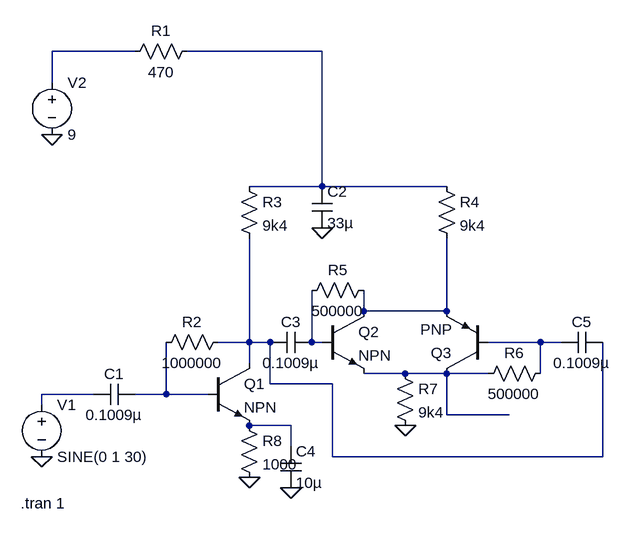
[diagram p0: schematic pushmepullyou.asc]
pushmepullyou.asc, the LTspice schematic file:
Version 4
SHEET 1 920 680
WIRE 128 -96 0 -96
WIRE 416 -96 208 -96
WIRE 0 -48 0 -96
WIRE 416 112 416 -96
WIRE 416 112 304 112
WIRE 608 112 416 112
WIRE 480 304 480 272
WIRE 608 304 608 192
WIRE 608 304 480 304
WIRE 304 352 304 192
WIRE 304 352 256 352
WIRE 336 352 304 352
WIRE 400 352 400 272
WIRE 416 352 400 352
WIRE 752 352 672 352
WIRE 784 352 752 352
WIRE 304 384 304 352
WIRE 544 400 480 400
WIRE 608 400 544 400
WIRE 672 400 608 400
WIRE 752 400 752 352
WIRE 336 416 336 352
WIRE 432 416 336 416
WIRE 64 432 -16 432
WIRE 176 432 176 352
WIRE 176 432 128 432
WIRE 240 432 176 432
WIRE -16 448 -16 432
WIRE 608 464 608 400
WIRE 704 464 608 464
WIRE 368 480 304 480
WIRE 368 512 368 480
WIRE 432 528 432 416
WIRE 848 528 848 352
WIRE 848 528 432 528
FLAG 416 176 0
FLAG -16 528 0
FLAG 0 32 0
FLAG 544 480 0
FLAG 368 576 0
FLAG 304 560 0
SYMBOL voltage -16 432 R0
WINDOW 123 0 0 Left 0
WINDOW 39 0 0 Left 0
SYMATTR InstName V1
SYMATTR Value SINE(0 1 30)
SYMBOL voltage 0 -64 R0
WINDOW 123 0 0 Left 0
WINDOW 39 0 0 Left 0
SYMATTR InstName V2
SYMATTR Value 9
SYMBOL res 224 -112 R90
WINDOW 0 0 56 VBottom 2
WINDOW 3 32 56 VTop 2
SYMATTR InstName R1
SYMATTR Value 470
SYMBOL res 272 336 R90
WINDOW 0 0 56 VBottom 2
WINDOW 3 32 56 VTop 2
SYMATTR InstName R2
SYMATTR Value 1000000
SYMBOL res 288 96 R0
SYMATTR InstName R3
SYMATTR Value 9k4
SYMBOL cap 400 112 R0
SYMATTR InstName C2
SYMATTR Value 33µ
SYMBOL res 592 96 R0
SYMATTR InstName R4
SYMATTR Value 9k4
SYMBOL cap 400 336 R90
WINDOW 0 0 32 VBottom 2
WINDOW 3 32 32 VTop 2
SYMATTR InstName C3
SYMATTR Value 0.1009µ
SYMBOL res 496 256 R90
WINDOW 0 0 56 VBottom 2
WINDOW 3 32 56 VTop 2
SYMATTR InstName R5
SYMATTR Value 500000
SYMBOL cap 352 512 R0
SYMATTR InstName C4
SYMATTR Value 10µ
SYMBOL npn 240 384 R0
SYMATTR InstName Q1
SYMBOL npn 416 304 R0
SYMATTR InstName Q2
SYMBOL pnp 672 400 R180
SYMATTR InstName Q3
SYMBOL res 768 384 R90
WINDOW 0 0 56 VBottom 2
WINDOW 3 32 56 VTop 2
SYMATTR InstName R6
SYMATTR Value 500000
SYMBOL cap 848 336 R90
WINDOW 0 0 32 VBottom 2
WINDOW 3 32 32 VTop 2
SYMATTR InstName C5
SYMATTR Value 0.1009µ
SYMBOL res 528 384 R0
SYMATTR InstName R7
SYMATTR Value 9k4
SYMBOL res 288 464 R0
SYMATTR InstName R8
SYMATTR Value 1000
SYMBOL cap 128 416 R90
WINDOW 0 0 32 VBottom 2
WINDOW 3 32 32 VTop 2
SYMATTR InstName C1
SYMATTR Value 0.1009µ
TEXT -48 600 Left 2 !.tran 1

The netlist it stands for:
* pushmepullyou.asc
V1 N008 0 SINE(0 1 30)
V2 N001 0 9
R1 N002 N001 470
R2 N004 N009 1000000
R3 N002 N004 9k4
C2 N002 0 33µ
R4 N002 N003 9k4
C3 N005 N004 0.1009µ
R5 N003 N005 500000
C4 N010 0 10µ
Q1 N004 N009 N010 0 NPN
Q2 N003 N005 N007 0 NPN
Q3 N007 N006 N003 0 PNP
R6 N006 N007 500000
C5 N004 N006 0.1009µ
R7 N007 0 9k4
R8 N010 0 1000
C1 N009 N008 0.1009µ
.model NPN NPN
.model PNP PNP
.lib standard.bjt
.tran 1
.backanno
.end